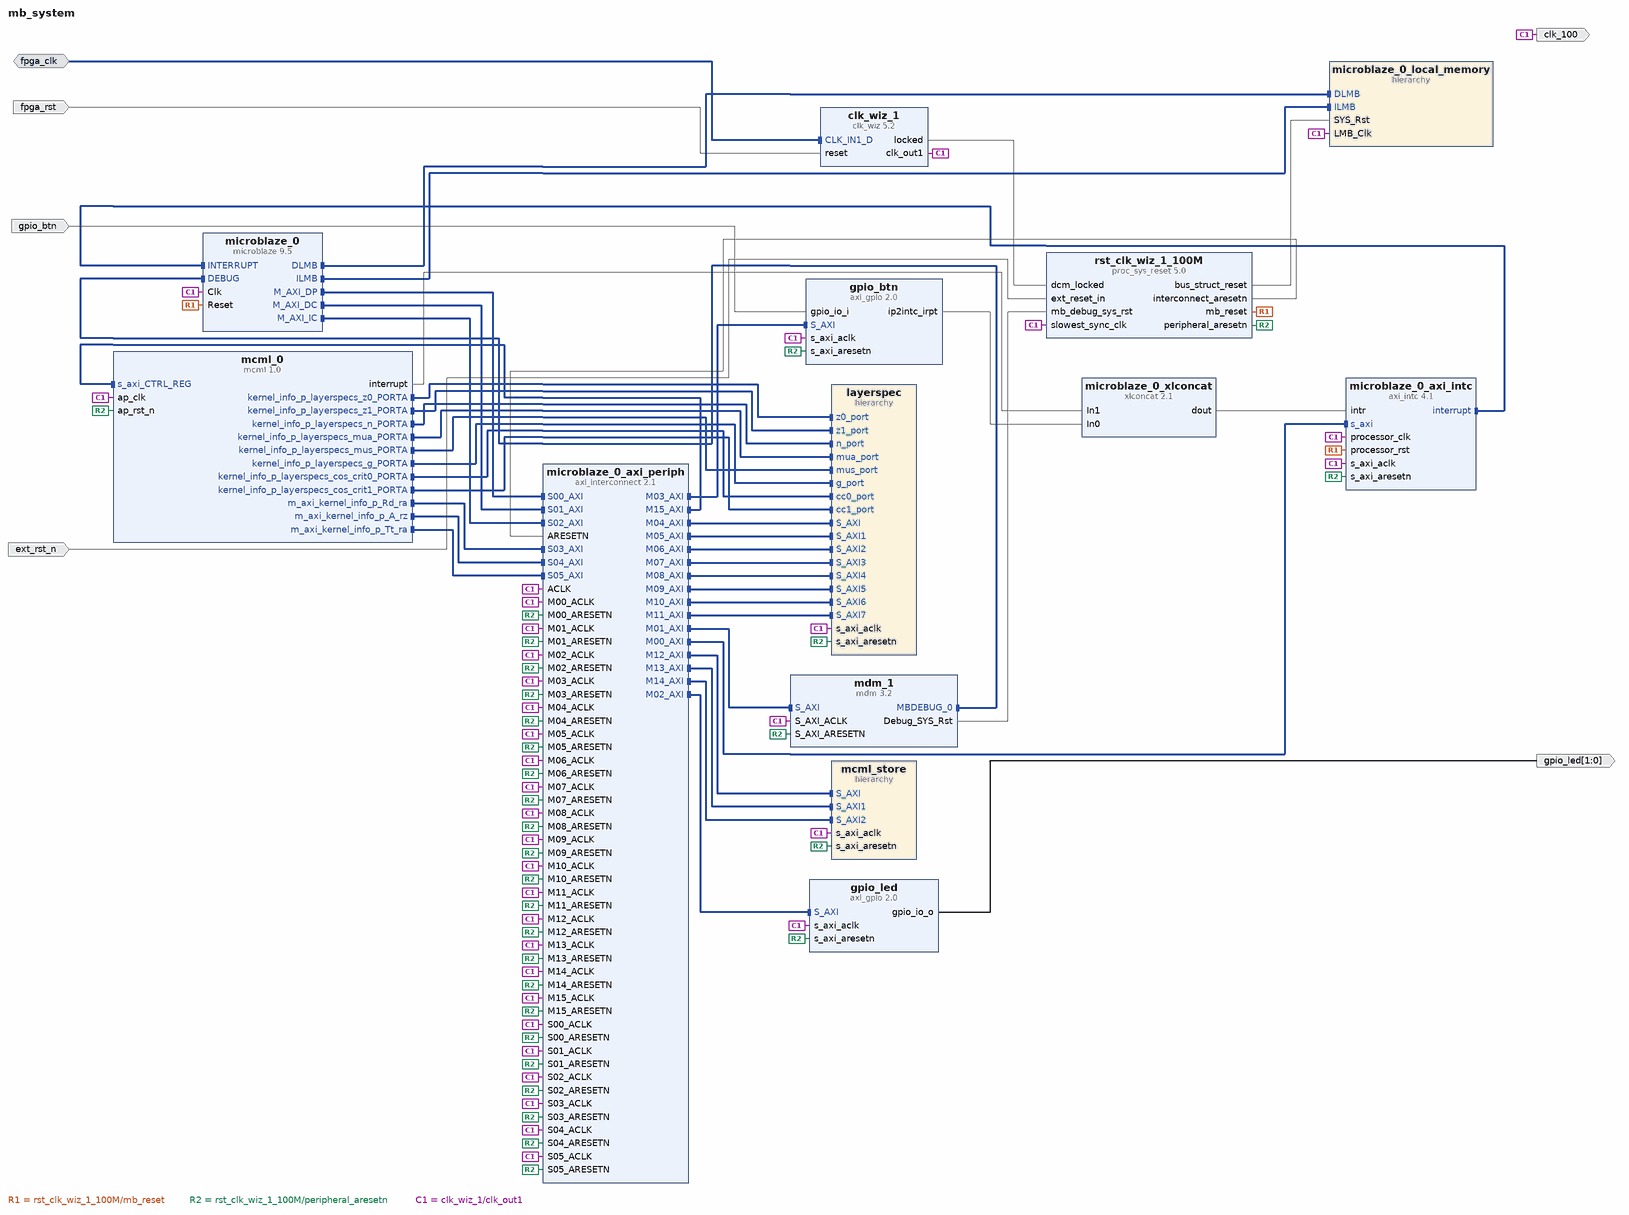
[diagram p0: block diagram of the top level]
# Vivado block design mb_system, Vivado 2015.4
create_bd_design mb_system

create_bd_intf_port -mode Slave -vlnv xilinx.com:interface:diff_clock_rtl:1.0 fpga_clk
set_property -dict {CONFIG.FREQ_HZ 200000000} [get_bd_intf_ports fpga_clk]
create_bd_port -dir I -type rst fpga_rst
set_property -dict {CONFIG.POLARITY ACTIVE_HIGH} [get_bd_ports fpga_rst]
create_bd_port -dir I -type rst ext_rst_n
set_property -dict {CONFIG.POLARITY ACTIVE_LOW} [get_bd_ports ext_rst_n]
create_bd_port -dir I -type data gpio_btn
create_bd_port -dir O -from 1 -to 0 gpio_led
create_bd_port -dir O -type clk clk_100

create_bd_cell -type ip -vlnv xilinx.com:ip:microblaze:9.5 microblaze_0
set_property -dict [list \
  CONFIG.C_D_AXI 1 \
  CONFIG.C_D_LMB 1 \
  CONFIG.C_I_LMB 1 \
  CONFIG.G_TEMPLATE_LIST 2 \
  CONFIG.C_USE_MSR_INSTR 1 \
  CONFIG.C_USE_PCMP_INSTR 1 \
  CONFIG.C_USE_BARREL 1 \
  CONFIG.C_USE_DIV 1 \
  CONFIG.C_USE_HW_MUL 2 \
  CONFIG.C_USE_FPU 2 \
  CONFIG.C_DEBUG_ENABLED 1 \
  CONFIG.C_USE_ICACHE 1 \
  CONFIG.C_CACHE_BYTE_SIZE 32768 \
  CONFIG.C_ICACHE_LINE_LEN 8 \
  CONFIG.C_ICACHE_VICTIMS 8 \
  CONFIG.C_ICACHE_STREAMS 1 \
  CONFIG.C_USE_DCACHE 1 \
  CONFIG.C_DCACHE_BYTE_SIZE 32768 \
  CONFIG.C_DCACHE_LINE_LEN 8 \
  CONFIG.C_DCACHE_USE_WRITEBACK 1 \
  CONFIG.C_DCACHE_VICTIMS 8 \
  CONFIG.C_USE_BRANCH_TARGET_CACHE 1 \
] [get_bd_cells microblaze_0]
create_bd_cell -type hier microblaze_0_local_memory
create_bd_cell -type ip -vlnv xilinx.com:ip:axi_interconnect:2.1 microblaze_0_axi_periph
set_property -dict [list \
  CONFIG.NUM_SI 6 \
  CONFIG.NUM_MI 16 \
  CONFIG.M12_HAS_DATA_FIFO 1 \
  CONFIG.M13_HAS_DATA_FIFO 1 \
  CONFIG.M14_HAS_DATA_FIFO 1 \
] [get_bd_cells microblaze_0_axi_periph]
create_bd_cell -type ip -vlnv xilinx.com:ip:axi_intc:4.1 microblaze_0_axi_intc
set_property -dict {CONFIG.C_HAS_FAST 1} [get_bd_cells microblaze_0_axi_intc]
create_bd_cell -type ip -vlnv xilinx.com:ip:xlconcat:2.1 microblaze_0_xlconcat
create_bd_cell -type ip -vlnv xilinx.com:ip:mdm:3.2 mdm_1
set_property -dict {CONFIG.C_USE_UART 1} [get_bd_cells mdm_1]
create_bd_cell -type ip -vlnv xilinx.com:ip:clk_wiz:5.2 clk_wiz_1
set_property -dict [list \
  CONFIG.PRIM_IN_FREQ 200.000 \
  CONFIG.CLKIN1_JITTER_PS 50.0 \
  CONFIG.CLKOUT1_REQUESTED_OUT_FREQ 100.000 \
  CONFIG.PRIM_SOURCE Differential_clock_capable_pin \
  CONFIG.MMCM_DIVCLK_DIVIDE 1 \
  CONFIG.MMCM_CLKFBOUT_MULT_F 5.000 \
  CONFIG.MMCM_CLKIN1_PERIOD 5.0 \
  CONFIG.MMCM_CLKOUT0_DIVIDE_F 10.000 \
  CONFIG.CLKOUT1_JITTER 112.316 \
  CONFIG.CLKOUT1_PHASE_ERROR 89.971 \
] [get_bd_cells clk_wiz_1]
create_bd_cell -type ip -vlnv xilinx.com:ip:proc_sys_reset:5.0 rst_clk_wiz_1_100M
create_bd_cell -type ip -vlnv xilinx.com:ip:axi_gpio:2.0 gpio_led
set_property -dict {CONFIG.C_GPIO_WIDTH 2 CONFIG.C_ALL_INPUTS 0 CONFIG.C_ALL_OUTPUTS 1} [get_bd_cells gpio_led]
create_bd_cell -type ip -vlnv xilinx.com:ip:axi_gpio:2.0 gpio_btn
set_property -dict {CONFIG.C_GPIO_WIDTH 1 CONFIG.C_ALL_INPUTS 1 CONFIG.C_INTERRUPT_PRESENT 1} [get_bd_cells gpio_btn]
create_bd_cell -type hier layerspec
create_bd_cell -type hier mcml_store
create_bd_cell -type ip -vlnv xilinx.com:hls:mcml:1.0 mcml_0
set_property -dict [list \
  CONFIG.C_M_AXI_KERNEL_INFO_P_RD_RA_TARGET_ADDR 0xD0000000 \
  CONFIG.C_M_AXI_KERNEL_INFO_P_A_RZ_TARGET_ADDR 0xD2000000 \
  CONFIG.C_M_AXI_KERNEL_INFO_P_TT_RA_TARGET_ADDR 0xD4000000 \
] [get_bd_cells mcml_0]

# ---- hierarchy /microblaze_0_local_memory ----
current_bd_instance /microblaze_0_local_memory
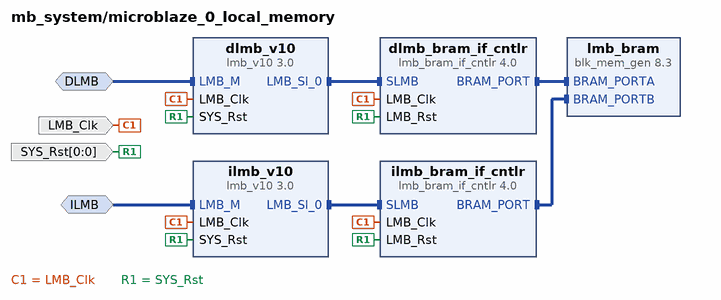
[diagram p1: block diagram inside /microblaze_0_local_memory]
create_bd_intf_pin -mode MirroredMaster -vlnv xilinx.com:interface:lmb_rtl:1.0 DLMB
create_bd_intf_pin -mode MirroredMaster -vlnv xilinx.com:interface:lmb_rtl:1.0 ILMB
create_bd_pin -dir I -type clk LMB_Clk
create_bd_pin -dir I -from 0 -to 0 -type rst SYS_Rst

create_bd_cell -type ip -vlnv xilinx.com:ip:lmb_v10:3.0 dlmb_v10
create_bd_cell -type ip -vlnv xilinx.com:ip:lmb_v10:3.0 ilmb_v10
create_bd_cell -type ip -vlnv xilinx.com:ip:lmb_bram_if_cntlr:4.0 dlmb_bram_if_cntlr
set_property -dict {CONFIG.C_ECC 0} [get_bd_cells dlmb_bram_if_cntlr]
create_bd_cell -type ip -vlnv xilinx.com:ip:lmb_bram_if_cntlr:4.0 ilmb_bram_if_cntlr
set_property -dict {CONFIG.C_ECC 0} [get_bd_cells ilmb_bram_if_cntlr]
create_bd_cell -type ip -vlnv xilinx.com:ip:blk_mem_gen:8.3 lmb_bram
set_property -dict {CONFIG.Memory_Type True_Dual_Port_RAM CONFIG.use_bram_block BRAM_Controller} [get_bd_cells lmb_bram]

# ---- hierarchy /layerspec ----
current_bd_instance /layerspec
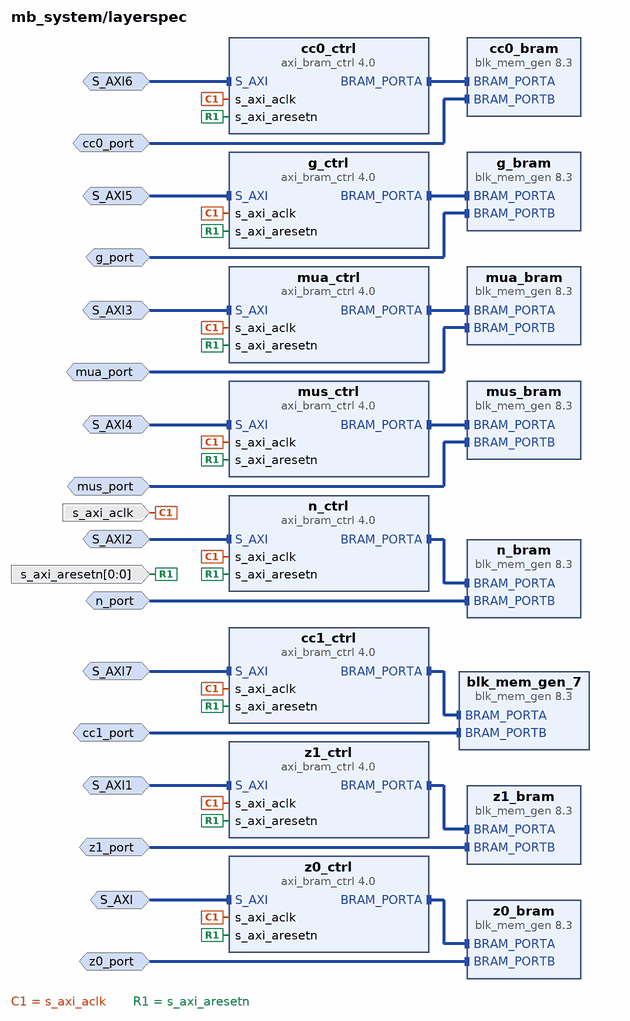
[diagram p2: block diagram inside /layerspec]
create_bd_intf_pin -mode Slave -vlnv xilinx.com:interface:aximm_rtl:1.0 S_AXI
create_bd_intf_pin -mode Slave -vlnv xilinx.com:interface:aximm_rtl:1.0 S_AXI1
create_bd_intf_pin -mode Slave -vlnv xilinx.com:interface:aximm_rtl:1.0 S_AXI2
create_bd_intf_pin -mode Slave -vlnv xilinx.com:interface:aximm_rtl:1.0 S_AXI3
create_bd_intf_pin -mode Slave -vlnv xilinx.com:interface:aximm_rtl:1.0 S_AXI4
create_bd_intf_pin -mode Slave -vlnv xilinx.com:interface:aximm_rtl:1.0 S_AXI5
create_bd_intf_pin -mode Slave -vlnv xilinx.com:interface:aximm_rtl:1.0 S_AXI6
create_bd_intf_pin -mode Slave -vlnv xilinx.com:interface:aximm_rtl:1.0 S_AXI7
create_bd_intf_pin -mode Slave -vlnv xilinx.com:interface:bram_rtl:1.0 z0_port
create_bd_intf_pin -mode Slave -vlnv xilinx.com:interface:bram_rtl:1.0 z1_port
create_bd_intf_pin -mode Slave -vlnv xilinx.com:interface:bram_rtl:1.0 n_port
create_bd_intf_pin -mode Slave -vlnv xilinx.com:interface:bram_rtl:1.0 mua_port
create_bd_intf_pin -mode Slave -vlnv xilinx.com:interface:bram_rtl:1.0 mus_port
create_bd_intf_pin -mode Slave -vlnv xilinx.com:interface:bram_rtl:1.0 g_port
create_bd_intf_pin -mode Slave -vlnv xilinx.com:interface:bram_rtl:1.0 cc0_port
create_bd_intf_pin -mode Slave -vlnv xilinx.com:interface:bram_rtl:1.0 cc1_port
create_bd_pin -dir I -type clk s_axi_aclk
create_bd_pin -dir I -from 0 -to 0 -type rst s_axi_aresetn

create_bd_cell -type ip -vlnv xilinx.com:ip:axi_bram_ctrl:4.0 z0_ctrl
set_property -dict {CONFIG.SINGLE_PORT_BRAM 1} [get_bd_cells z0_ctrl]
create_bd_cell -type ip -vlnv xilinx.com:ip:blk_mem_gen:8.3 z0_bram
set_property -dict [list \
  CONFIG.Memory_Type True_Dual_Port_RAM \
  CONFIG.Enable_B Use_ENB_Pin \
  CONFIG.Use_RSTB_Pin true \
  CONFIG.Port_B_Clock 100 \
  CONFIG.Port_B_Write_Rate 50 \
  CONFIG.Port_B_Enable_Rate 100 \
] [get_bd_cells z0_bram]
create_bd_cell -type ip -vlnv xilinx.com:ip:axi_bram_ctrl:4.0 n_ctrl
set_property -dict {CONFIG.SINGLE_PORT_BRAM 1} [get_bd_cells n_ctrl]
create_bd_cell -type ip -vlnv xilinx.com:ip:blk_mem_gen:8.3 mua_bram
set_property -dict [list \
  CONFIG.Memory_Type True_Dual_Port_RAM \
  CONFIG.Enable_B Use_ENB_Pin \
  CONFIG.Use_RSTB_Pin true \
  CONFIG.Port_B_Clock 100 \
  CONFIG.Port_B_Write_Rate 50 \
  CONFIG.Port_B_Enable_Rate 100 \
] [get_bd_cells mua_bram]
create_bd_cell -type ip -vlnv xilinx.com:ip:axi_bram_ctrl:4.0 mua_ctrl
set_property -dict {CONFIG.SINGLE_PORT_BRAM 1} [get_bd_cells mua_ctrl]
create_bd_cell -type ip -vlnv xilinx.com:ip:axi_bram_ctrl:4.0 mus_ctrl
set_property -dict {CONFIG.SINGLE_PORT_BRAM 1} [get_bd_cells mus_ctrl]
create_bd_cell -type ip -vlnv xilinx.com:ip:blk_mem_gen:8.3 mus_bram
set_property -dict [list \
  CONFIG.Memory_Type True_Dual_Port_RAM \
  CONFIG.Enable_B Use_ENB_Pin \
  CONFIG.Use_RSTB_Pin true \
  CONFIG.Port_B_Clock 100 \
  CONFIG.Port_B_Write_Rate 50 \
  CONFIG.Port_B_Enable_Rate 100 \
] [get_bd_cells mus_bram]
create_bd_cell -type ip -vlnv xilinx.com:ip:axi_bram_ctrl:4.0 z1_ctrl
set_property -dict {CONFIG.SINGLE_PORT_BRAM 1} [get_bd_cells z1_ctrl]
create_bd_cell -type ip -vlnv xilinx.com:ip:blk_mem_gen:8.3 z1_bram
set_property -dict [list \
  CONFIG.Memory_Type True_Dual_Port_RAM \
  CONFIG.Enable_B Use_ENB_Pin \
  CONFIG.Use_RSTB_Pin true \
  CONFIG.Port_B_Clock 100 \
  CONFIG.Port_B_Write_Rate 50 \
  CONFIG.Port_B_Enable_Rate 100 \
] [get_bd_cells z1_bram]
create_bd_cell -type ip -vlnv xilinx.com:ip:axi_bram_ctrl:4.0 g_ctrl
set_property -dict {CONFIG.SINGLE_PORT_BRAM 1} [get_bd_cells g_ctrl]
create_bd_cell -type ip -vlnv xilinx.com:ip:blk_mem_gen:8.3 g_bram
set_property -dict [list \
  CONFIG.Memory_Type True_Dual_Port_RAM \
  CONFIG.Enable_B Use_ENB_Pin \
  CONFIG.Use_RSTB_Pin true \
  CONFIG.Port_B_Clock 100 \
  CONFIG.Port_B_Write_Rate 50 \
  CONFIG.Port_B_Enable_Rate 100 \
] [get_bd_cells g_bram]
create_bd_cell -type ip -vlnv xilinx.com:ip:axi_bram_ctrl:4.0 cc0_ctrl
set_property -dict {CONFIG.SINGLE_PORT_BRAM 1} [get_bd_cells cc0_ctrl]
create_bd_cell -type ip -vlnv xilinx.com:ip:blk_mem_gen:8.3 cc0_bram
set_property -dict [list \
  CONFIG.Memory_Type True_Dual_Port_RAM \
  CONFIG.Enable_B Use_ENB_Pin \
  CONFIG.Use_RSTB_Pin true \
  CONFIG.Port_B_Clock 100 \
  CONFIG.Port_B_Write_Rate 50 \
  CONFIG.Port_B_Enable_Rate 100 \
] [get_bd_cells cc0_bram]
create_bd_cell -type ip -vlnv xilinx.com:ip:blk_mem_gen:8.3 n_bram
set_property -dict [list \
  CONFIG.Memory_Type True_Dual_Port_RAM \
  CONFIG.Enable_B Use_ENB_Pin \
  CONFIG.Use_RSTB_Pin true \
  CONFIG.Port_B_Clock 100 \
  CONFIG.Port_B_Write_Rate 50 \
  CONFIG.Port_B_Enable_Rate 100 \
] [get_bd_cells n_bram]
create_bd_cell -type ip -vlnv xilinx.com:ip:axi_bram_ctrl:4.0 cc1_ctrl
set_property -dict {CONFIG.SINGLE_PORT_BRAM 1} [get_bd_cells cc1_ctrl]
create_bd_cell -type ip -vlnv xilinx.com:ip:blk_mem_gen:8.3 blk_mem_gen_7
set_property -dict [list \
  CONFIG.Memory_Type True_Dual_Port_RAM \
  CONFIG.Enable_B Use_ENB_Pin \
  CONFIG.Use_RSTB_Pin true \
  CONFIG.Port_B_Clock 100 \
  CONFIG.Port_B_Write_Rate 50 \
  CONFIG.Port_B_Enable_Rate 100 \
] [get_bd_cells blk_mem_gen_7]

# ---- hierarchy /mcml_store ----
current_bd_instance /mcml_store
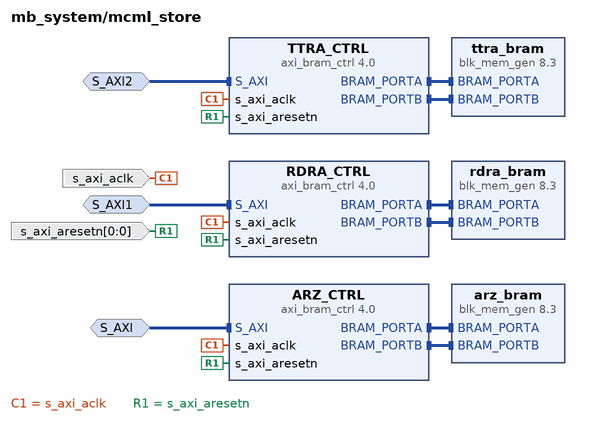
[diagram p3: block diagram inside /mcml_store]
create_bd_intf_pin -mode Slave -vlnv xilinx.com:interface:aximm_rtl:1.0 S_AXI
create_bd_intf_pin -mode Slave -vlnv xilinx.com:interface:aximm_rtl:1.0 S_AXI1
create_bd_intf_pin -mode Slave -vlnv xilinx.com:interface:aximm_rtl:1.0 S_AXI2
create_bd_pin -dir I -type clk s_axi_aclk
create_bd_pin -dir I -from 0 -to 0 -type rst s_axi_aresetn

create_bd_cell -type ip -vlnv xilinx.com:ip:blk_mem_gen:8.3 rdra_bram
set_property -dict [list \
  CONFIG.Memory_Type True_Dual_Port_RAM \
  CONFIG.Enable_B Use_ENB_Pin \
  CONFIG.Use_RSTB_Pin true \
  CONFIG.Port_B_Clock 100 \
  CONFIG.Port_B_Write_Rate 50 \
  CONFIG.Port_B_Enable_Rate 100 \
] [get_bd_cells rdra_bram]
create_bd_cell -type ip -vlnv xilinx.com:ip:axi_bram_ctrl:4.0 ARZ_CTRL
create_bd_cell -type ip -vlnv xilinx.com:ip:blk_mem_gen:8.3 arz_bram
set_property -dict [list \
  CONFIG.Memory_Type True_Dual_Port_RAM \
  CONFIG.Enable_B Use_ENB_Pin \
  CONFIG.Use_RSTB_Pin true \
  CONFIG.Port_B_Clock 100 \
  CONFIG.Port_B_Write_Rate 50 \
  CONFIG.Port_B_Enable_Rate 100 \
] [get_bd_cells arz_bram]
create_bd_cell -type ip -vlnv xilinx.com:ip:axi_bram_ctrl:4.0 RDRA_CTRL
create_bd_cell -type ip -vlnv xilinx.com:ip:axi_bram_ctrl:4.0 TTRA_CTRL
create_bd_cell -type ip -vlnv xilinx.com:ip:blk_mem_gen:8.3 ttra_bram
set_property -dict [list \
  CONFIG.Memory_Type True_Dual_Port_RAM \
  CONFIG.Enable_B Use_ENB_Pin \
  CONFIG.Use_RSTB_Pin true \
  CONFIG.Port_B_Clock 100 \
  CONFIG.Port_B_Write_Rate 50 \
  CONFIG.Port_B_Enable_Rate 100 \
] [get_bd_cells ttra_bram]

# ---- connections ----

current_bd_instance /microblaze_0_local_memory
connect_bd_intf_net -intf_net microblaze_0_dlmb_bus [get_bd_intf_pins dlmb_v10/LMB_Sl_0] [get_bd_intf_pins dlmb_bram_if_cntlr/SLMB]
connect_bd_intf_net -intf_net microblaze_0_ilmb_bus [get_bd_intf_pins ilmb_v10/LMB_Sl_0] [get_bd_intf_pins ilmb_bram_if_cntlr/SLMB]
connect_bd_intf_net -intf_net microblaze_0_dlmb_cntlr [get_bd_intf_pins dlmb_bram_if_cntlr/BRAM_PORT] [get_bd_intf_pins lmb_bram/BRAM_PORTA]
connect_bd_intf_net -intf_net microblaze_0_ilmb_cntlr [get_bd_intf_pins ilmb_bram_if_cntlr/BRAM_PORT] [get_bd_intf_pins lmb_bram/BRAM_PORTB]
connect_bd_intf_net -intf_net microblaze_0_dlmb [get_bd_intf_pins DLMB] [get_bd_intf_pins dlmb_v10/LMB_M]
connect_bd_intf_net -intf_net microblaze_0_ilmb [get_bd_intf_pins ILMB] [get_bd_intf_pins ilmb_v10/LMB_M]
connect_bd_net -net microblaze_0_Clk [get_bd_pins LMB_Clk] \
  [get_bd_pins dlmb_v10/LMB_Clk] [get_bd_pins dlmb_bram_if_cntlr/LMB_Clk] [get_bd_pins ilmb_v10/LMB_Clk] \
  [get_bd_pins ilmb_bram_if_cntlr/LMB_Clk]
connect_bd_net [get_bd_pins SYS_Rst] \
  [get_bd_pins dlmb_v10/SYS_Rst] [get_bd_pins dlmb_bram_if_cntlr/LMB_Rst] [get_bd_pins ilmb_v10/SYS_Rst] \
  [get_bd_pins ilmb_bram_if_cntlr/LMB_Rst]

current_bd_instance /layerspec
connect_bd_intf_net -intf_net axi_bram_ctrl_0_BRAM_PORTA [get_bd_intf_pins z0_bram/BRAM_PORTA] [get_bd_intf_pins z0_ctrl/BRAM_PORTA]
connect_bd_intf_net -intf_net axi_bram_ctrl_0_BRAM_PORTA_1 [get_bd_intf_pins mus_bram/BRAM_PORTA] [get_bd_intf_pins mus_ctrl/BRAM_PORTA]
connect_bd_intf_net -intf_net axi_bram_ctrl_0_BRAM_PORTA_2 [get_bd_intf_pins z1_bram/BRAM_PORTA] [get_bd_intf_pins z1_ctrl/BRAM_PORTA]
connect_bd_intf_net -intf_net axi_bram_ctrl_0_BRAM_PORTA_3 [get_bd_intf_pins g_bram/BRAM_PORTA] [get_bd_intf_pins g_ctrl/BRAM_PORTA]
connect_bd_intf_net -intf_net axi_bram_ctrl_0_BRAM_PORTA_4 [get_bd_intf_pins cc0_bram/BRAM_PORTA] [get_bd_intf_pins cc0_ctrl/BRAM_PORTA]
connect_bd_intf_net -intf_net axi_bram_ctrl_0_BRAM_PORTA_5 [get_bd_intf_pins blk_mem_gen_7/BRAM_PORTA] [get_bd_intf_pins cc1_ctrl/BRAM_PORTA]
connect_bd_intf_net -intf_net axi_bram_ctrl_1_BRAM_PORTA [get_bd_intf_pins n_ctrl/BRAM_PORTA] [get_bd_intf_pins n_bram/BRAM_PORTA]
connect_bd_intf_net -intf_net axi_bram_ctrl_2_BRAM_PORTA [get_bd_intf_pins mua_ctrl/BRAM_PORTA] [get_bd_intf_pins mua_bram/BRAM_PORTA]
connect_bd_intf_net [get_bd_intf_pins S_AXI] [get_bd_intf_pins z0_ctrl/S_AXI]
connect_bd_intf_net -intf_net S_AXI1_1 [get_bd_intf_pins S_AXI1] [get_bd_intf_pins z1_ctrl/S_AXI]
connect_bd_intf_net -intf_net S_AXI2_1 [get_bd_intf_pins S_AXI2] [get_bd_intf_pins n_ctrl/S_AXI]
connect_bd_intf_net -intf_net S_AXI3_1 [get_bd_intf_pins S_AXI3] [get_bd_intf_pins mua_ctrl/S_AXI]
connect_bd_intf_net -intf_net S_AXI4_1 [get_bd_intf_pins S_AXI4] [get_bd_intf_pins mus_ctrl/S_AXI]
connect_bd_intf_net -intf_net S_AXI5_1 [get_bd_intf_pins S_AXI5] [get_bd_intf_pins g_ctrl/S_AXI]
connect_bd_intf_net -intf_net S_AXI6_1 [get_bd_intf_pins S_AXI6] [get_bd_intf_pins cc0_ctrl/S_AXI]
connect_bd_intf_net -intf_net S_AXI7_1 [get_bd_intf_pins S_AXI7] [get_bd_intf_pins cc1_ctrl/S_AXI]
connect_bd_intf_net [get_bd_intf_pins z0_port] [get_bd_intf_pins z0_bram/BRAM_PORTB]
connect_bd_intf_net [get_bd_intf_pins z1_port] [get_bd_intf_pins z1_bram/BRAM_PORTB]
connect_bd_intf_net [get_bd_intf_pins n_port] [get_bd_intf_pins n_bram/BRAM_PORTB]
connect_bd_intf_net [get_bd_intf_pins mua_port] [get_bd_intf_pins mua_bram/BRAM_PORTB]
connect_bd_intf_net [get_bd_intf_pins mus_port] [get_bd_intf_pins mus_bram/BRAM_PORTB]
connect_bd_intf_net [get_bd_intf_pins g_port] [get_bd_intf_pins g_bram/BRAM_PORTB]
connect_bd_intf_net [get_bd_intf_pins cc0_port] [get_bd_intf_pins cc0_bram/BRAM_PORTB]
connect_bd_intf_net [get_bd_intf_pins cc1_port] [get_bd_intf_pins blk_mem_gen_7/BRAM_PORTB]
connect_bd_net [get_bd_pins s_axi_aclk] \
  [get_bd_pins cc0_ctrl/s_axi_aclk] [get_bd_pins cc1_ctrl/s_axi_aclk] [get_bd_pins g_ctrl/s_axi_aclk] \
  [get_bd_pins mua_ctrl/s_axi_aclk] [get_bd_pins mus_ctrl/s_axi_aclk] [get_bd_pins n_ctrl/s_axi_aclk] \
  [get_bd_pins z0_ctrl/s_axi_aclk] [get_bd_pins z1_ctrl/s_axi_aclk]
connect_bd_net [get_bd_pins s_axi_aresetn] \
  [get_bd_pins cc0_ctrl/s_axi_aresetn] [get_bd_pins cc1_ctrl/s_axi_aresetn] [get_bd_pins g_ctrl/s_axi_aresetn] \
  [get_bd_pins mua_ctrl/s_axi_aresetn] [get_bd_pins mus_ctrl/s_axi_aresetn] [get_bd_pins n_ctrl/s_axi_aresetn] \
  [get_bd_pins z0_ctrl/s_axi_aresetn] [get_bd_pins z1_ctrl/s_axi_aresetn]

current_bd_instance /mcml_store
connect_bd_intf_net -intf_net axi_bram_ctrl_0_BRAM_PORTA_1 [get_bd_intf_pins arz_bram/BRAM_PORTA] [get_bd_intf_pins ARZ_CTRL/BRAM_PORTA]
connect_bd_intf_net -intf_net axi_bram_ctrl_0_BRAM_PORTB_1 [get_bd_intf_pins arz_bram/BRAM_PORTB] [get_bd_intf_pins ARZ_CTRL/BRAM_PORTB]
connect_bd_intf_net -intf_net axi_bram_ctrl_0_BRAM_PORTA [get_bd_intf_pins rdra_bram/BRAM_PORTA] [get_bd_intf_pins RDRA_CTRL/BRAM_PORTA]
connect_bd_intf_net -intf_net axi_bram_ctrl_0_BRAM_PORTB [get_bd_intf_pins rdra_bram/BRAM_PORTB] [get_bd_intf_pins RDRA_CTRL/BRAM_PORTB]
connect_bd_intf_net -intf_net axi_bram_ctrl_0_BRAM_PORTA_2 [get_bd_intf_pins ttra_bram/BRAM_PORTA] [get_bd_intf_pins TTRA_CTRL/BRAM_PORTA]
connect_bd_intf_net -intf_net axi_bram_ctrl_0_BRAM_PORTB_2 [get_bd_intf_pins ttra_bram/BRAM_PORTB] [get_bd_intf_pins TTRA_CTRL/BRAM_PORTB]
connect_bd_intf_net [get_bd_intf_pins S_AXI] [get_bd_intf_pins ARZ_CTRL/S_AXI]
connect_bd_intf_net [get_bd_intf_pins S_AXI1] [get_bd_intf_pins RDRA_CTRL/S_AXI]
connect_bd_intf_net [get_bd_intf_pins S_AXI2] [get_bd_intf_pins TTRA_CTRL/S_AXI]
connect_bd_net [get_bd_pins s_axi_aclk] [get_bd_pins ARZ_CTRL/s_axi_aclk] [get_bd_pins RDRA_CTRL/s_axi_aclk] [get_bd_pins TTRA_CTRL/s_axi_aclk]
connect_bd_net [get_bd_pins s_axi_aresetn] \
  [get_bd_pins TTRA_CTRL/s_axi_aresetn] [get_bd_pins RDRA_CTRL/s_axi_aresetn] [get_bd_pins ARZ_CTRL/s_axi_aresetn]

current_bd_instance /
connect_bd_intf_net [get_bd_intf_pins microblaze_0/DLMB] [get_bd_intf_pins microblaze_0_local_memory/DLMB]
connect_bd_intf_net [get_bd_intf_pins microblaze_0/ILMB] [get_bd_intf_pins microblaze_0_local_memory/ILMB]
connect_bd_intf_net -intf_net microblaze_0_axi_dp [get_bd_intf_pins microblaze_0_axi_periph/S00_AXI] [get_bd_intf_pins microblaze_0/M_AXI_DP]
connect_bd_intf_net [get_bd_intf_pins microblaze_0_axi_intc/interrupt] [get_bd_intf_pins microblaze_0/INTERRUPT]
connect_bd_intf_net -intf_net microblaze_0_intc_axi [get_bd_intf_pins microblaze_0_axi_periph/M00_AXI] [get_bd_intf_pins microblaze_0_axi_intc/s_axi]
connect_bd_intf_net [get_bd_intf_pins mdm_1/MBDEBUG_0] [get_bd_intf_pins microblaze_0/DEBUG]
connect_bd_intf_net -intf_net microblaze_0_mdm_axi [get_bd_intf_pins microblaze_0_axi_periph/M01_AXI] [get_bd_intf_pins mdm_1/S_AXI]
connect_bd_intf_net [get_bd_intf_pins microblaze_0_axi_periph/M02_AXI] [get_bd_intf_pins gpio_led/S_AXI]
connect_bd_intf_net [get_bd_intf_pins microblaze_0_axi_periph/M03_AXI] [get_bd_intf_pins gpio_btn/S_AXI]
connect_bd_intf_net [get_bd_intf_pins microblaze_0/M_AXI_DC] [get_bd_intf_pins microblaze_0_axi_periph/S01_AXI]
connect_bd_intf_net [get_bd_intf_pins microblaze_0/M_AXI_IC] [get_bd_intf_pins microblaze_0_axi_periph/S02_AXI]
connect_bd_intf_net [get_bd_intf_pins layerspec/S_AXI] [get_bd_intf_pins microblaze_0_axi_periph/M04_AXI]
connect_bd_intf_net -intf_net S_AXI1_1 [get_bd_intf_pins layerspec/S_AXI1] [get_bd_intf_pins microblaze_0_axi_periph/M05_AXI]
connect_bd_intf_net -intf_net S_AXI2_1 [get_bd_intf_pins layerspec/S_AXI2] [get_bd_intf_pins microblaze_0_axi_periph/M06_AXI]
connect_bd_intf_net -intf_net S_AXI3_1 [get_bd_intf_pins layerspec/S_AXI3] [get_bd_intf_pins microblaze_0_axi_periph/M07_AXI]
connect_bd_intf_net -intf_net S_AXI4_1 [get_bd_intf_pins layerspec/S_AXI4] [get_bd_intf_pins microblaze_0_axi_periph/M08_AXI]
connect_bd_intf_net -intf_net S_AXI5_1 [get_bd_intf_pins layerspec/S_AXI5] [get_bd_intf_pins microblaze_0_axi_periph/M09_AXI]
connect_bd_intf_net -intf_net S_AXI6_1 [get_bd_intf_pins layerspec/S_AXI6] [get_bd_intf_pins microblaze_0_axi_periph/M10_AXI]
connect_bd_intf_net -intf_net S_AXI7_1 [get_bd_intf_pins layerspec/S_AXI7] [get_bd_intf_pins microblaze_0_axi_periph/M11_AXI]
connect_bd_intf_net [get_bd_intf_pins microblaze_0_axi_periph/M12_AXI] [get_bd_intf_pins mcml_store/S_AXI]
connect_bd_intf_net [get_bd_intf_pins microblaze_0_axi_periph/M13_AXI] [get_bd_intf_pins mcml_store/S_AXI1]
connect_bd_intf_net [get_bd_intf_pins microblaze_0_axi_periph/M14_AXI] [get_bd_intf_pins mcml_store/S_AXI2]
connect_bd_intf_net [get_bd_intf_pins mcml_0/m_axi_kernel_info_p_Rd_ra] [get_bd_intf_pins microblaze_0_axi_periph/S03_AXI]
connect_bd_intf_net [get_bd_intf_pins mcml_0/m_axi_kernel_info_p_A_rz] [get_bd_intf_pins microblaze_0_axi_periph/S04_AXI]
connect_bd_intf_net [get_bd_intf_pins mcml_0/m_axi_kernel_info_p_Tt_ra] [get_bd_intf_pins microblaze_0_axi_periph/S05_AXI]
connect_bd_intf_net [get_bd_intf_pins mcml_0/kernel_info_p_layerspecs_z0_PORTA] [get_bd_intf_pins layerspec/z0_port]
connect_bd_intf_net [get_bd_intf_pins mcml_0/kernel_info_p_layerspecs_z1_PORTA] [get_bd_intf_pins layerspec/z1_port]
connect_bd_intf_net [get_bd_intf_pins mcml_0/kernel_info_p_layerspecs_n_PORTA] [get_bd_intf_pins layerspec/n_port]
connect_bd_intf_net [get_bd_intf_pins mcml_0/kernel_info_p_layerspecs_mua_PORTA] [get_bd_intf_pins layerspec/mua_port]
connect_bd_intf_net [get_bd_intf_pins mcml_0/kernel_info_p_layerspecs_mus_PORTA] [get_bd_intf_pins layerspec/mus_port]
connect_bd_intf_net [get_bd_intf_pins mcml_0/kernel_info_p_layerspecs_g_PORTA] [get_bd_intf_pins layerspec/g_port]
connect_bd_intf_net [get_bd_intf_pins mcml_0/kernel_info_p_layerspecs_cos_crit0_PORTA] [get_bd_intf_pins layerspec/cc0_port]
connect_bd_intf_net [get_bd_intf_pins mcml_0/kernel_info_p_layerspecs_cos_crit1_PORTA] [get_bd_intf_pins layerspec/cc1_port]
connect_bd_intf_net [get_bd_intf_pins microblaze_0_axi_periph/M15_AXI] [get_bd_intf_pins mcml_0/s_axi_CTRL_REG]
connect_bd_intf_net -intf_net diff_clock_rtl_1 [get_bd_intf_ports fpga_clk] [get_bd_intf_pins clk_wiz_1/CLK_IN1_D]
connect_bd_net -net microblaze_0_intr [get_bd_pins microblaze_0_xlconcat/dout] [get_bd_pins microblaze_0_axi_intc/intr]
connect_bd_net [get_bd_pins clk_wiz_1/locked] [get_bd_pins rst_clk_wiz_1_100M/dcm_locked]
connect_bd_net [get_bd_pins rst_clk_wiz_1_100M/mb_reset] [get_bd_pins microblaze_0/Reset] [get_bd_pins microblaze_0_axi_intc/processor_rst]
connect_bd_net [get_bd_pins rst_clk_wiz_1_100M/bus_struct_reset] [get_bd_pins microblaze_0_local_memory/SYS_Rst]
connect_bd_net [get_bd_pins rst_clk_wiz_1_100M/interconnect_aresetn] [get_bd_pins microblaze_0_axi_periph/ARESETN]
connect_bd_net [get_bd_pins rst_clk_wiz_1_100M/peripheral_aresetn] \
  [get_bd_pins mdm_1/S_AXI_ARESETN] [get_bd_pins microblaze_0_axi_intc/s_axi_aresetn] [get_bd_pins gpio_led/s_axi_aresetn] \
  [get_bd_pins gpio_btn/s_axi_aresetn] [get_bd_pins microblaze_0_axi_periph/S00_ARESETN] \
  [get_bd_pins microblaze_0_axi_periph/M00_ARESETN] [get_bd_pins microblaze_0_axi_periph/M01_ARESETN] \
  [get_bd_pins microblaze_0_axi_periph/M02_ARESETN] [get_bd_pins microblaze_0_axi_periph/M03_ARESETN] \
  [get_bd_pins microblaze_0_axi_periph/S01_ARESETN] [get_bd_pins microblaze_0_axi_periph/S02_ARESETN] \
  [get_bd_pins microblaze_0_axi_periph/M04_ARESETN] [get_bd_pins microblaze_0_axi_periph/M05_ARESETN] \
  [get_bd_pins microblaze_0_axi_periph/M06_ARESETN] [get_bd_pins microblaze_0_axi_periph/M07_ARESETN] \
  [get_bd_pins microblaze_0_axi_periph/M08_ARESETN] [get_bd_pins microblaze_0_axi_periph/M09_ARESETN] \
  [get_bd_pins microblaze_0_axi_periph/M10_ARESETN] [get_bd_pins microblaze_0_axi_periph/M11_ARESETN] \
  [get_bd_pins layerspec/s_axi_aresetn] [get_bd_pins mcml_store/s_axi_aresetn] \
  [get_bd_pins microblaze_0_axi_periph/S03_ARESETN] [get_bd_pins microblaze_0_axi_periph/M13_ARESETN] \
  [get_bd_pins microblaze_0_axi_periph/S04_ARESETN] [get_bd_pins microblaze_0_axi_periph/M12_ARESETN] \
  [get_bd_pins microblaze_0_axi_periph/S05_ARESETN] [get_bd_pins microblaze_0_axi_periph/M14_ARESETN] \
  [get_bd_pins microblaze_0_axi_periph/M15_ARESETN] [get_bd_pins mcml_0/ap_rst_n]
connect_bd_net [get_bd_pins mdm_1/Debug_SYS_Rst] [get_bd_pins rst_clk_wiz_1_100M/mb_debug_sys_rst]
connect_bd_net -net reset_rtl_1 [get_bd_ports fpga_rst] [get_bd_pins clk_wiz_1/reset]
connect_bd_net -net reset_rtl_0_1 [get_bd_ports ext_rst_n] [get_bd_pins rst_clk_wiz_1_100M/ext_reset_in]
connect_bd_net [get_bd_ports gpio_btn] [get_bd_pins gpio_btn/gpio_io_i]
connect_bd_net [get_bd_pins gpio_led/gpio_io_o] [get_bd_ports gpio_led]
connect_bd_net [get_bd_pins gpio_btn/ip2intc_irpt] [get_bd_pins microblaze_0_xlconcat/In0]
connect_bd_net -net microblaze_0_Clk [get_bd_pins clk_wiz_1/clk_out1] \
  [get_bd_ports clk_100] [get_bd_pins microblaze_0/Clk] [get_bd_pins microblaze_0_axi_intc/s_axi_aclk] \
  [get_bd_pins microblaze_0_axi_intc/processor_clk] [get_bd_pins mdm_1/S_AXI_ACLK] \
  [get_bd_pins rst_clk_wiz_1_100M/slowest_sync_clk] [get_bd_pins gpio_led/s_axi_aclk] [get_bd_pins gpio_btn/s_axi_aclk] \
  [get_bd_pins microblaze_0_axi_periph/ACLK] [get_bd_pins microblaze_0_axi_periph/S00_ACLK] \
  [get_bd_pins microblaze_0_axi_periph/M00_ACLK] [get_bd_pins microblaze_0_axi_periph/M01_ACLK] \
  [get_bd_pins microblaze_0_local_memory/LMB_Clk] [get_bd_pins microblaze_0_axi_periph/M02_ACLK] \
  [get_bd_pins microblaze_0_axi_periph/M03_ACLK] [get_bd_pins microblaze_0_axi_periph/S01_ACLK] \
  [get_bd_pins microblaze_0_axi_periph/S02_ACLK] [get_bd_pins microblaze_0_axi_periph/M04_ACLK] \
  [get_bd_pins microblaze_0_axi_periph/M05_ACLK] [get_bd_pins microblaze_0_axi_periph/M06_ACLK] \
  [get_bd_pins microblaze_0_axi_periph/M07_ACLK] [get_bd_pins microblaze_0_axi_periph/M08_ACLK] \
  [get_bd_pins microblaze_0_axi_periph/M09_ACLK] [get_bd_pins microblaze_0_axi_periph/M10_ACLK] \
  [get_bd_pins microblaze_0_axi_periph/M11_ACLK] [get_bd_pins layerspec/s_axi_aclk] [get_bd_pins mcml_store/s_axi_aclk] \
  [get_bd_pins microblaze_0_axi_periph/S03_ACLK] [get_bd_pins microblaze_0_axi_periph/M13_ACLK] \
  [get_bd_pins microblaze_0_axi_periph/S04_ACLK] [get_bd_pins microblaze_0_axi_periph/M12_ACLK] \
  [get_bd_pins microblaze_0_axi_periph/S05_ACLK] [get_bd_pins microblaze_0_axi_periph/M14_ACLK] \
  [get_bd_pins microblaze_0_axi_periph/M15_ACLK] [get_bd_pins mcml_0/ap_clk]
connect_bd_net [get_bd_pins mcml_0/interrupt] [get_bd_pins microblaze_0_xlconcat/In1]

# ---- address map ----
assign_bd_address -offset 0xD2000000 -range 64K -target_address_space [get_bd_addr_spaces mcml_0/Data_m_axi_kernel_info_p_A_rz] [get_bd_addr_segs mcml_store/ARZ_CTRL/S_AXI/Mem0]
exclude_bd_addr_seg -offset 0x40000000 -range 64K -target_address_space [get_bd_addr_spaces mcml_0/Data_m_axi_kernel_info_p_A_rz] [get_bd_addr_segs gpio_led/S_AXI/Reg]
exclude_bd_addr_seg -offset 0x40010000 -range 64K -target_address_space [get_bd_addr_spaces mcml_0/Data_m_axi_kernel_info_p_A_rz] [get_bd_addr_segs gpio_btn/S_AXI/Reg]
exclude_bd_addr_seg -offset 0x41200000 -range 64K -target_address_space [get_bd_addr_spaces mcml_0/Data_m_axi_kernel_info_p_A_rz] [get_bd_addr_segs microblaze_0_axi_intc/s_axi/Reg]
exclude_bd_addr_seg -offset 0x41400000 -range 4K -target_address_space [get_bd_addr_spaces mcml_0/Data_m_axi_kernel_info_p_A_rz] [get_bd_addr_segs mdm_1/S_AXI/Reg]
exclude_bd_addr_seg -offset 0x44A00000 -range 64K -target_address_space [get_bd_addr_spaces mcml_0/Data_m_axi_kernel_info_p_A_rz] [get_bd_addr_segs mcml_0/s_axi_CTRL_REG/Reg]
exclude_bd_addr_seg -offset 0xC0000000 -range 4K -target_address_space [get_bd_addr_spaces mcml_0/Data_m_axi_kernel_info_p_A_rz] [get_bd_addr_segs layerspec/z0_ctrl/S_AXI/Mem0]
exclude_bd_addr_seg -offset 0xC2000000 -range 4K -target_address_space [get_bd_addr_spaces mcml_0/Data_m_axi_kernel_info_p_A_rz] [get_bd_addr_segs layerspec/z1_ctrl/S_AXI/Mem0]
exclude_bd_addr_seg -offset 0xC4000000 -range 4K -target_address_space [get_bd_addr_spaces mcml_0/Data_m_axi_kernel_info_p_A_rz] [get_bd_addr_segs layerspec/n_ctrl/S_AXI/Mem0]
exclude_bd_addr_seg -offset 0xC6000000 -range 4K -target_address_space [get_bd_addr_spaces mcml_0/Data_m_axi_kernel_info_p_A_rz] [get_bd_addr_segs layerspec/mua_ctrl/S_AXI/Mem0]
exclude_bd_addr_seg -offset 0xC8000000 -range 4K -target_address_space [get_bd_addr_spaces mcml_0/Data_m_axi_kernel_info_p_A_rz] [get_bd_addr_segs layerspec/mus_ctrl/S_AXI/Mem0]
exclude_bd_addr_seg -offset 0xCA000000 -range 4K -target_address_space [get_bd_addr_spaces mcml_0/Data_m_axi_kernel_info_p_A_rz] [get_bd_addr_segs layerspec/g_ctrl/S_AXI/Mem0]
exclude_bd_addr_seg -offset 0xCC000000 -range 4K -target_address_space [get_bd_addr_spaces mcml_0/Data_m_axi_kernel_info_p_A_rz] [get_bd_addr_segs layerspec/cc0_ctrl/S_AXI/Mem0]
exclude_bd_addr_seg -offset 0xCE000000 -range 4K -target_address_space [get_bd_addr_spaces mcml_0/Data_m_axi_kernel_info_p_A_rz] [get_bd_addr_segs layerspec/cc1_ctrl/S_AXI/Mem0]
exclude_bd_addr_seg -offset 0xD0000000 -range 64K -target_address_space [get_bd_addr_spaces mcml_0/Data_m_axi_kernel_info_p_A_rz] [get_bd_addr_segs mcml_store/RDRA_CTRL/S_AXI/Mem0]
exclude_bd_addr_seg -offset 0xD4000000 -range 64K -target_address_space [get_bd_addr_spaces mcml_0/Data_m_axi_kernel_info_p_A_rz] [get_bd_addr_segs mcml_store/TTRA_CTRL/S_AXI/Mem0]
assign_bd_address -offset 0xD0000000 -range 64K -target_address_space [get_bd_addr_spaces mcml_0/Data_m_axi_kernel_info_p_Rd_ra] [get_bd_addr_segs mcml_store/RDRA_CTRL/S_AXI/Mem0]
exclude_bd_addr_seg -offset 0x40000000 -range 64K -target_address_space [get_bd_addr_spaces mcml_0/Data_m_axi_kernel_info_p_Rd_ra] [get_bd_addr_segs gpio_led/S_AXI/Reg]
exclude_bd_addr_seg -offset 0x40010000 -range 64K -target_address_space [get_bd_addr_spaces mcml_0/Data_m_axi_kernel_info_p_Rd_ra] [get_bd_addr_segs gpio_btn/S_AXI/Reg]
exclude_bd_addr_seg -offset 0x41200000 -range 64K -target_address_space [get_bd_addr_spaces mcml_0/Data_m_axi_kernel_info_p_Rd_ra] [get_bd_addr_segs microblaze_0_axi_intc/s_axi/Reg]
exclude_bd_addr_seg -offset 0x41400000 -range 4K -target_address_space [get_bd_addr_spaces mcml_0/Data_m_axi_kernel_info_p_Rd_ra] [get_bd_addr_segs mdm_1/S_AXI/Reg]
exclude_bd_addr_seg -offset 0x44A00000 -range 64K -target_address_space [get_bd_addr_spaces mcml_0/Data_m_axi_kernel_info_p_Rd_ra] [get_bd_addr_segs mcml_0/s_axi_CTRL_REG/Reg]
exclude_bd_addr_seg -offset 0xC0000000 -range 4K -target_address_space [get_bd_addr_spaces mcml_0/Data_m_axi_kernel_info_p_Rd_ra] [get_bd_addr_segs layerspec/z0_ctrl/S_AXI/Mem0]
exclude_bd_addr_seg -offset 0xC2000000 -range 4K -target_address_space [get_bd_addr_spaces mcml_0/Data_m_axi_kernel_info_p_Rd_ra] [get_bd_addr_segs layerspec/z1_ctrl/S_AXI/Mem0]
exclude_bd_addr_seg -offset 0xC4000000 -range 4K -target_address_space [get_bd_addr_spaces mcml_0/Data_m_axi_kernel_info_p_Rd_ra] [get_bd_addr_segs layerspec/n_ctrl/S_AXI/Mem0]
exclude_bd_addr_seg -offset 0xC6000000 -range 4K -target_address_space [get_bd_addr_spaces mcml_0/Data_m_axi_kernel_info_p_Rd_ra] [get_bd_addr_segs layerspec/mua_ctrl/S_AXI/Mem0]
exclude_bd_addr_seg -offset 0xC8000000 -range 4K -target_address_space [get_bd_addr_spaces mcml_0/Data_m_axi_kernel_info_p_Rd_ra] [get_bd_addr_segs layerspec/mus_ctrl/S_AXI/Mem0]
exclude_bd_addr_seg -offset 0xCA000000 -range 4K -target_address_space [get_bd_addr_spaces mcml_0/Data_m_axi_kernel_info_p_Rd_ra] [get_bd_addr_segs layerspec/g_ctrl/S_AXI/Mem0]
exclude_bd_addr_seg -offset 0xCC000000 -range 4K -target_address_space [get_bd_addr_spaces mcml_0/Data_m_axi_kernel_info_p_Rd_ra] [get_bd_addr_segs layerspec/cc0_ctrl/S_AXI/Mem0]
exclude_bd_addr_seg -offset 0xCE000000 -range 4K -target_address_space [get_bd_addr_spaces mcml_0/Data_m_axi_kernel_info_p_Rd_ra] [get_bd_addr_segs layerspec/cc1_ctrl/S_AXI/Mem0]
exclude_bd_addr_seg -offset 0xD2000000 -range 64K -target_address_space [get_bd_addr_spaces mcml_0/Data_m_axi_kernel_info_p_Rd_ra] [get_bd_addr_segs mcml_store/ARZ_CTRL/S_AXI/Mem0]
exclude_bd_addr_seg -offset 0xD4000000 -range 64K -target_address_space [get_bd_addr_spaces mcml_0/Data_m_axi_kernel_info_p_Rd_ra] [get_bd_addr_segs mcml_store/TTRA_CTRL/S_AXI/Mem0]
assign_bd_address -offset 0xD4000000 -range 64K -target_address_space [get_bd_addr_spaces mcml_0/Data_m_axi_kernel_info_p_Tt_ra] [get_bd_addr_segs mcml_store/TTRA_CTRL/S_AXI/Mem0]
exclude_bd_addr_seg -offset 0x40000000 -range 64K -target_address_space [get_bd_addr_spaces mcml_0/Data_m_axi_kernel_info_p_Tt_ra] [get_bd_addr_segs gpio_led/S_AXI/Reg]
exclude_bd_addr_seg -offset 0x40010000 -range 64K -target_address_space [get_bd_addr_spaces mcml_0/Data_m_axi_kernel_info_p_Tt_ra] [get_bd_addr_segs gpio_btn/S_AXI/Reg]
exclude_bd_addr_seg -offset 0x41200000 -range 64K -target_address_space [get_bd_addr_spaces mcml_0/Data_m_axi_kernel_info_p_Tt_ra] [get_bd_addr_segs microblaze_0_axi_intc/s_axi/Reg]
exclude_bd_addr_seg -offset 0x41400000 -range 4K -target_address_space [get_bd_addr_spaces mcml_0/Data_m_axi_kernel_info_p_Tt_ra] [get_bd_addr_segs mdm_1/S_AXI/Reg]
exclude_bd_addr_seg -offset 0x44A00000 -range 64K -target_address_space [get_bd_addr_spaces mcml_0/Data_m_axi_kernel_info_p_Tt_ra] [get_bd_addr_segs mcml_0/s_axi_CTRL_REG/Reg]
exclude_bd_addr_seg -offset 0xC0000000 -range 4K -target_address_space [get_bd_addr_spaces mcml_0/Data_m_axi_kernel_info_p_Tt_ra] [get_bd_addr_segs layerspec/z0_ctrl/S_AXI/Mem0]
exclude_bd_addr_seg -offset 0xC2000000 -range 4K -target_address_space [get_bd_addr_spaces mcml_0/Data_m_axi_kernel_info_p_Tt_ra] [get_bd_addr_segs layerspec/z1_ctrl/S_AXI/Mem0]
exclude_bd_addr_seg -offset 0xC4000000 -range 4K -target_address_space [get_bd_addr_spaces mcml_0/Data_m_axi_kernel_info_p_Tt_ra] [get_bd_addr_segs layerspec/n_ctrl/S_AXI/Mem0]
exclude_bd_addr_seg -offset 0xC6000000 -range 4K -target_address_space [get_bd_addr_spaces mcml_0/Data_m_axi_kernel_info_p_Tt_ra] [get_bd_addr_segs layerspec/mua_ctrl/S_AXI/Mem0]
exclude_bd_addr_seg -offset 0xC8000000 -range 4K -target_address_space [get_bd_addr_spaces mcml_0/Data_m_axi_kernel_info_p_Tt_ra] [get_bd_addr_segs layerspec/mus_ctrl/S_AXI/Mem0]
exclude_bd_addr_seg -offset 0xCA000000 -range 4K -target_address_space [get_bd_addr_spaces mcml_0/Data_m_axi_kernel_info_p_Tt_ra] [get_bd_addr_segs layerspec/g_ctrl/S_AXI/Mem0]
exclude_bd_addr_seg -offset 0xCC000000 -range 4K -target_address_space [get_bd_addr_spaces mcml_0/Data_m_axi_kernel_info_p_Tt_ra] [get_bd_addr_segs layerspec/cc0_ctrl/S_AXI/Mem0]
exclude_bd_addr_seg -offset 0xCE000000 -range 4K -target_address_space [get_bd_addr_spaces mcml_0/Data_m_axi_kernel_info_p_Tt_ra] [get_bd_addr_segs layerspec/cc1_ctrl/S_AXI/Mem0]
exclude_bd_addr_seg -offset 0xD0000000 -range 64K -target_address_space [get_bd_addr_spaces mcml_0/Data_m_axi_kernel_info_p_Tt_ra] [get_bd_addr_segs mcml_store/RDRA_CTRL/S_AXI/Mem0]
exclude_bd_addr_seg -offset 0xD2000000 -range 64K -target_address_space [get_bd_addr_spaces mcml_0/Data_m_axi_kernel_info_p_Tt_ra] [get_bd_addr_segs mcml_store/ARZ_CTRL/S_AXI/Mem0]
assign_bd_address -offset 0x00000000 -range 32K -target_address_space [get_bd_addr_spaces microblaze_0/Data] [get_bd_addr_segs microblaze_0_local_memory/dlmb_bram_if_cntlr/SLMB/Mem]
assign_bd_address -offset 0x40000000 -range 64K -target_address_space [get_bd_addr_spaces microblaze_0/Data] [get_bd_addr_segs gpio_led/S_AXI/Reg]
assign_bd_address -offset 0x40010000 -range 64K -target_address_space [get_bd_addr_spaces microblaze_0/Data] [get_bd_addr_segs gpio_btn/S_AXI/Reg]
assign_bd_address -offset 0x41200000 -range 64K -target_address_space [get_bd_addr_spaces microblaze_0/Data] [get_bd_addr_segs microblaze_0_axi_intc/s_axi/Reg]
assign_bd_address -offset 0x41400000 -range 4K -target_address_space [get_bd_addr_spaces microblaze_0/Data] [get_bd_addr_segs mdm_1/S_AXI/Reg]
assign_bd_address -offset 0x44A00000 -range 64K -target_address_space [get_bd_addr_spaces microblaze_0/Data] [get_bd_addr_segs mcml_0/s_axi_CTRL_REG/Reg]
assign_bd_address -offset 0xC0000000 -range 4K -target_address_space [get_bd_addr_spaces microblaze_0/Data] [get_bd_addr_segs layerspec/z0_ctrl/S_AXI/Mem0]
assign_bd_address -offset 0xC2000000 -range 4K -target_address_space [get_bd_addr_spaces microblaze_0/Data] [get_bd_addr_segs layerspec/z1_ctrl/S_AXI/Mem0]
assign_bd_address -offset 0xC4000000 -range 4K -target_address_space [get_bd_addr_spaces microblaze_0/Data] [get_bd_addr_segs layerspec/n_ctrl/S_AXI/Mem0]
assign_bd_address -offset 0xC6000000 -range 4K -target_address_space [get_bd_addr_spaces microblaze_0/Data] [get_bd_addr_segs layerspec/mua_ctrl/S_AXI/Mem0]
assign_bd_address -offset 0xC8000000 -range 4K -target_address_space [get_bd_addr_spaces microblaze_0/Data] [get_bd_addr_segs layerspec/mus_ctrl/S_AXI/Mem0]
assign_bd_address -offset 0xCA000000 -range 4K -target_address_space [get_bd_addr_spaces microblaze_0/Data] [get_bd_addr_segs layerspec/g_ctrl/S_AXI/Mem0]
assign_bd_address -offset 0xCC000000 -range 4K -target_address_space [get_bd_addr_spaces microblaze_0/Data] [get_bd_addr_segs layerspec/cc0_ctrl/S_AXI/Mem0]
assign_bd_address -offset 0xCE000000 -range 4K -target_address_space [get_bd_addr_spaces microblaze_0/Data] [get_bd_addr_segs layerspec/cc1_ctrl/S_AXI/Mem0]
assign_bd_address -offset 0xD0000000 -range 64K -target_address_space [get_bd_addr_spaces microblaze_0/Data] [get_bd_addr_segs mcml_store/RDRA_CTRL/S_AXI/Mem0]
assign_bd_address -offset 0xD2000000 -range 64K -target_address_space [get_bd_addr_spaces microblaze_0/Data] [get_bd_addr_segs mcml_store/ARZ_CTRL/S_AXI/Mem0]
assign_bd_address -offset 0xD4000000 -range 64K -target_address_space [get_bd_addr_spaces microblaze_0/Data] [get_bd_addr_segs mcml_store/TTRA_CTRL/S_AXI/Mem0]
assign_bd_address -offset 0x00000000 -range 32K -target_address_space [get_bd_addr_spaces microblaze_0/Instruction] [get_bd_addr_segs microblaze_0_local_memory/ilmb_bram_if_cntlr/SLMB/Mem]
assign_bd_address -offset 0x40000000 -range 64K -target_address_space [get_bd_addr_spaces microblaze_0/Instruction] [get_bd_addr_segs gpio_led/S_AXI/Reg]
assign_bd_address -offset 0x40010000 -range 64K -target_address_space [get_bd_addr_spaces microblaze_0/Instruction] [get_bd_addr_segs gpio_btn/S_AXI/Reg]
assign_bd_address -offset 0x41200000 -range 64K -target_address_space [get_bd_addr_spaces microblaze_0/Instruction] [get_bd_addr_segs microblaze_0_axi_intc/s_axi/Reg]
assign_bd_address -offset 0x41400000 -range 4K -target_address_space [get_bd_addr_spaces microblaze_0/Instruction] [get_bd_addr_segs mdm_1/S_AXI/Reg]
assign_bd_address -offset 0x44A00000 -range 64K -target_address_space [get_bd_addr_spaces microblaze_0/Instruction] [get_bd_addr_segs mcml_0/s_axi_CTRL_REG/Reg]
assign_bd_address -offset 0xC0000000 -range 4K -target_address_space [get_bd_addr_spaces microblaze_0/Instruction] [get_bd_addr_segs layerspec/z0_ctrl/S_AXI/Mem0]
assign_bd_address -offset 0xC2000000 -range 4K -target_address_space [get_bd_addr_spaces microblaze_0/Instruction] [get_bd_addr_segs layerspec/z1_ctrl/S_AXI/Mem0]
assign_bd_address -offset 0xC4000000 -range 4K -target_address_space [get_bd_addr_spaces microblaze_0/Instruction] [get_bd_addr_segs layerspec/n_ctrl/S_AXI/Mem0]
assign_bd_address -offset 0xC6000000 -range 4K -target_address_space [get_bd_addr_spaces microblaze_0/Instruction] [get_bd_addr_segs layerspec/mua_ctrl/S_AXI/Mem0]
assign_bd_address -offset 0xC8000000 -range 4K -target_address_space [get_bd_addr_spaces microblaze_0/Instruction] [get_bd_addr_segs layerspec/mus_ctrl/S_AXI/Mem0]
assign_bd_address -offset 0xCA000000 -range 4K -target_address_space [get_bd_addr_spaces microblaze_0/Instruction] [get_bd_addr_segs layerspec/g_ctrl/S_AXI/Mem0]
assign_bd_address -offset 0xCC000000 -range 4K -target_address_space [get_bd_addr_spaces microblaze_0/Instruction] [get_bd_addr_segs layerspec/cc0_ctrl/S_AXI/Mem0]
assign_bd_address -offset 0xCE000000 -range 4K -target_address_space [get_bd_addr_spaces microblaze_0/Instruction] [get_bd_addr_segs layerspec/cc1_ctrl/S_AXI/Mem0]
assign_bd_address -offset 0xD0000000 -range 64K -target_address_space [get_bd_addr_spaces microblaze_0/Instruction] [get_bd_addr_segs mcml_store/RDRA_CTRL/S_AXI/Mem0]
assign_bd_address -offset 0xD2000000 -range 64K -target_address_space [get_bd_addr_spaces microblaze_0/Instruction] [get_bd_addr_segs mcml_store/ARZ_CTRL/S_AXI/Mem0]
assign_bd_address -offset 0xD4000000 -range 64K -target_address_space [get_bd_addr_spaces microblaze_0/Instruction] [get_bd_addr_segs mcml_store/TTRA_CTRL/S_AXI/Mem0]

validate_bd_design
save_bd_design
